# EAGLE design App_Board_V1.31 (EAGLE 9.6.2)
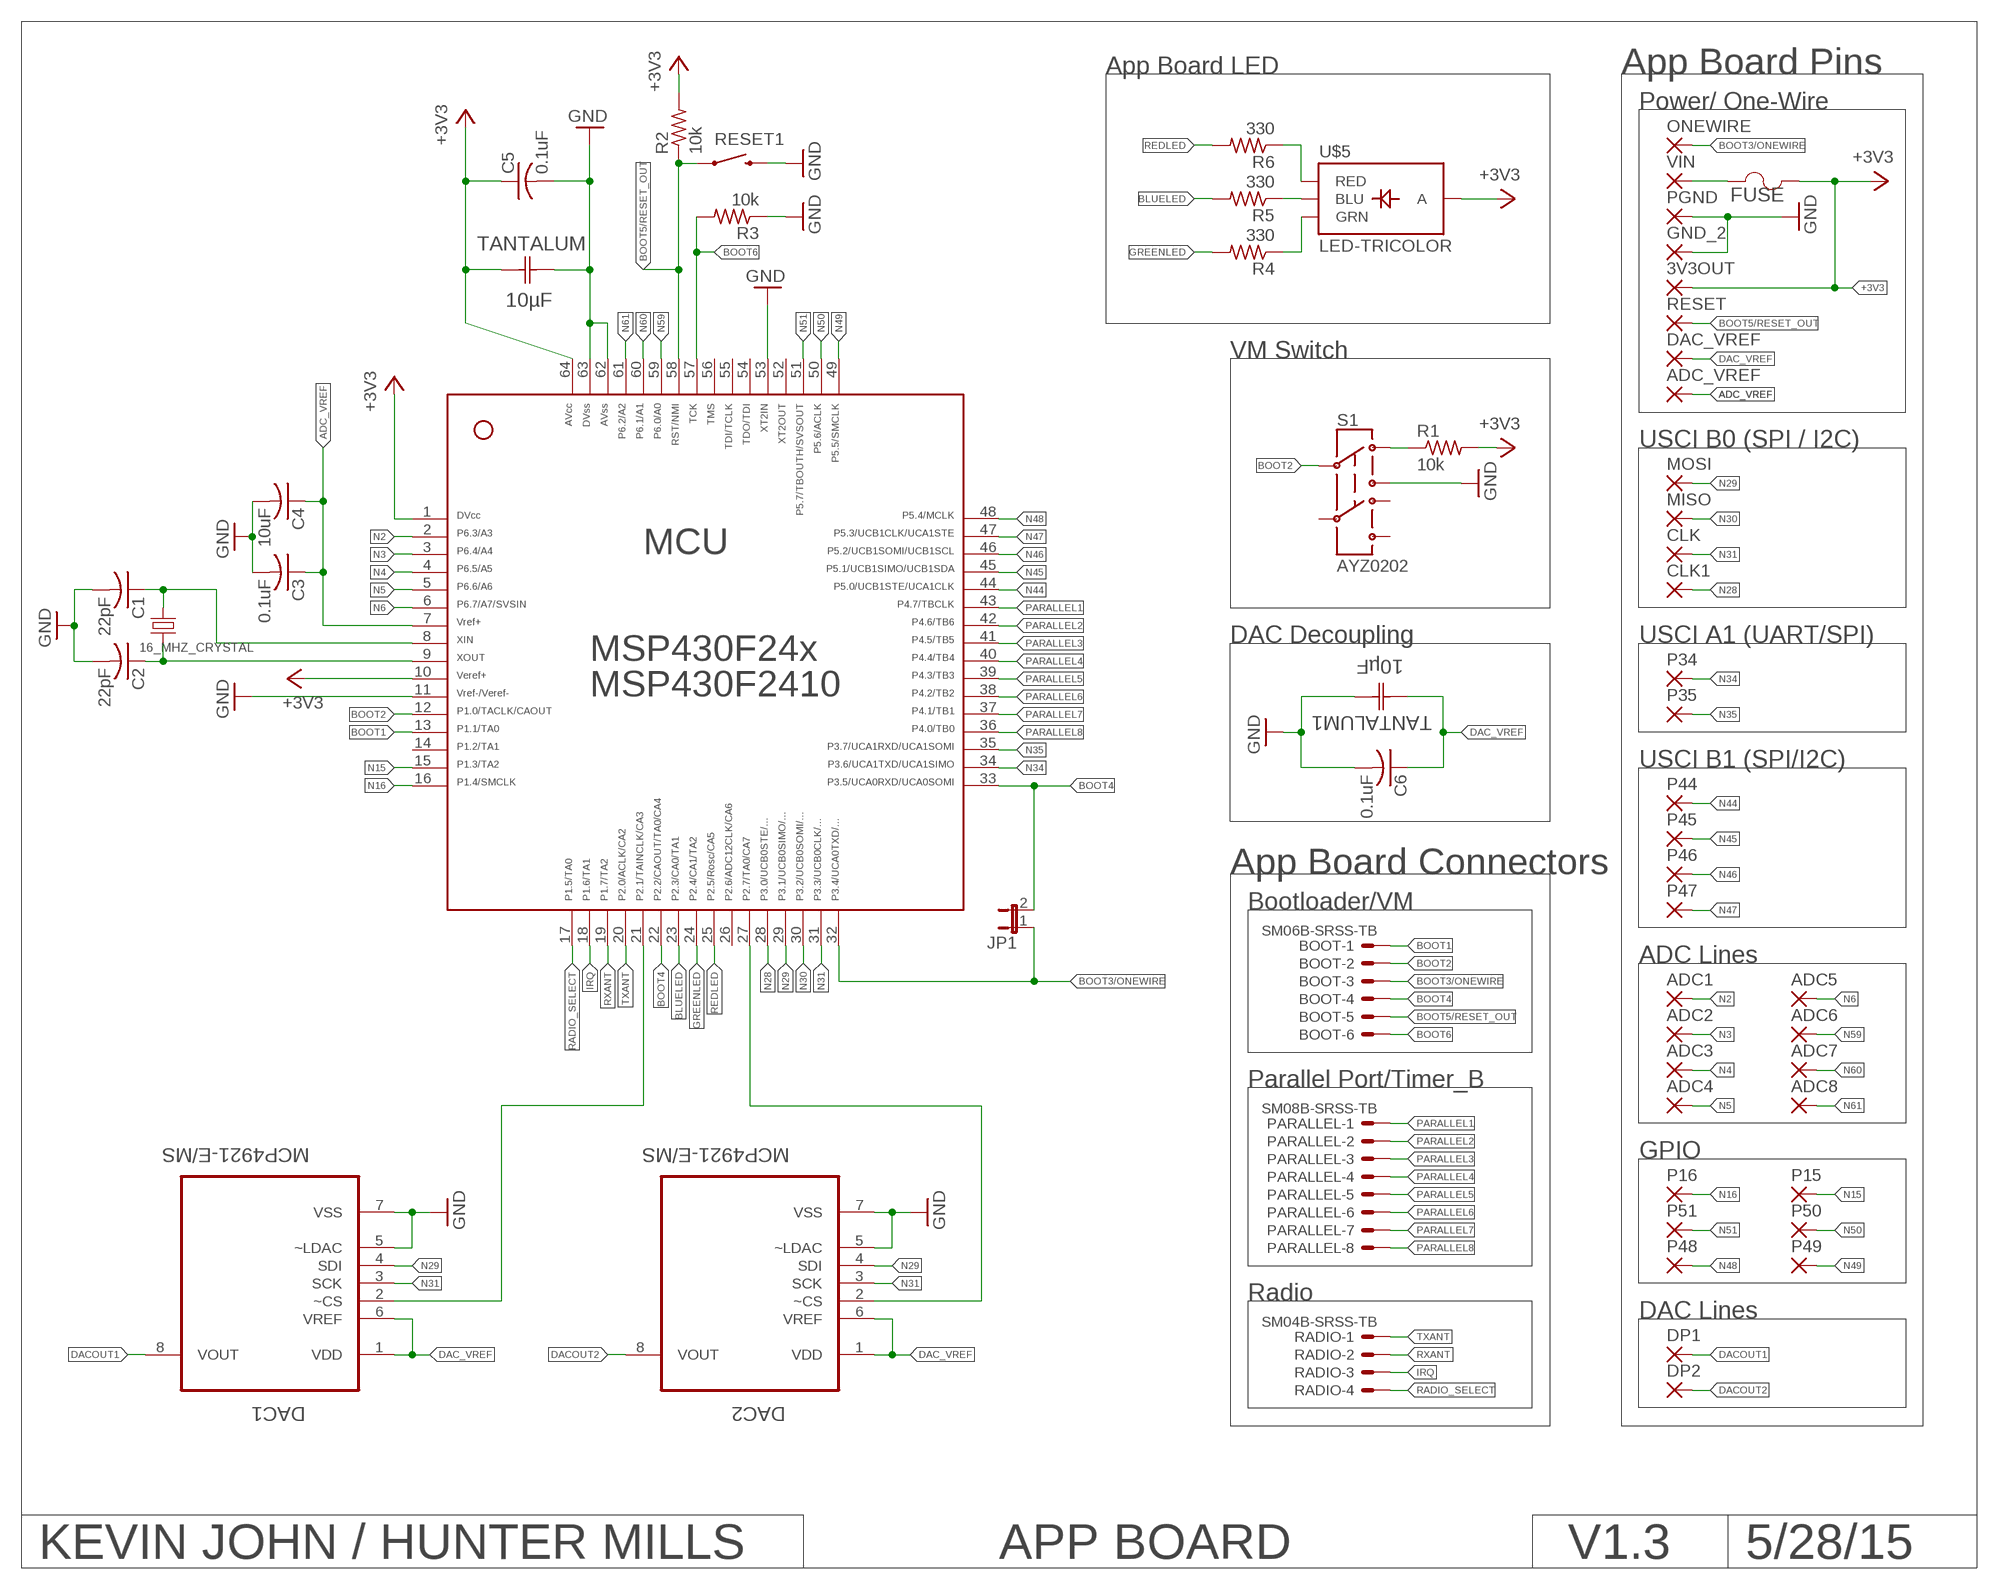
[diagram p0: schematic, sheet 1]

## Parts
3V3OUT  1,6/0,9  [1,6/0,9]
16_MHZ_CRYSTAL  HUNTERCRYSTAL  [CRYSTAL-SMD-5X3]
ADC1  1,6/0,9  [1,6/0,9]
ADC2  1,6/0,9  [1,6/0,9]
ADC3  1,6/0,9  [1,6/0,9]
ADC4  1,6/0,9  [1,6/0,9]
ADC5  1,6/0,9  [1,6/0,9]
ADC6  1,6/0,9  [1,6/0,9]
ADC7  1,6/0,9  [1,6/0,9]
ADC8  1,6/0,9  [1,6/0,9]
ADC_VREF  1,6/0,9  [1,6/0,9]
BOOT  SM06B-SRSS-TB  [SM06B-SRSS-TB]
C1  22pF  C-USC0805  [C0805]
C2  22pF  C-USC0805  [C0805]
C3  0.1uF  C-USC0805  [C0805]
C4  10uF  C-USC0805  [C0805]
C5  0.1uF  C-USC0805  [C0805]
C6  0.1uF  C-USC0805  [C0805]
CLK  1,6/0,9  [1,6/0,9]
CLK1  1,6/0,9  [1,6/0,9]
DAC1  MCP4921-E/MS  [SOP65P490X110-8N]
DAC2  MCP4921-E/MS  [SOP65P490X110-8N]
DAC_VREF  1,6/0,9  [1,6/0,9]
DP1  1,6/0,9  [1,6/0,9]
DP2  1,6/0,9  [1,6/0,9]
FUSE  HUNTERFUSE  [CAPC4532X254N]
GND_2  1,6/0,9  [1,6/0,9]
JP1  JP1E  [JP1]
MCU  F24[X/10]---PM64  [PM/PAG64]
MISO  1,6/0,9  [1,6/0,9]
MOSI  1,6/0,9  [1,6/0,9]
ONEWIRE  1,6/0,9  [1,6/0,9]
P15  1,6/0,9  [1,6/0,9]
P16  1,6/0,9  [1,6/0,9]
P34  1,6/0,9  [1,6/0,9]
P35  1,6/0,9  [1,6/0,9]
P44  1,6/0,9  [1,6/0,9]
P45  1,6/0,9  [1,6/0,9]
P46  1,6/0,9  [1,6/0,9]
P47  1,6/0,9  [1,6/0,9]
P48  1,6/0,9  [1,6/0,9]
P49  1,6/0,9  [1,6/0,9]
P50  1,6/0,9  [1,6/0,9]
P51  1,6/0,9  [1,6/0,9]
PARALLEL  SM08B-SRSS-TB  [SM08B-SRSS-TB]
PGND  1,6/0,9  [1,6/0,9]
R1  10k  R-US_R0603  [R0603]
R2  10k  R-US_R0603  [R0603]
R3  10k  R-US_R0603  [R0603]
R4  330  R-US_R0603  [R0603]
R5  330  R-US_R0603  [R0603]
R6  330  R-US_R0603  [R0603]
RADIO  SM04B-SRSS-TB  [SM04B-SRSS-TB]
RESET  1,6/0,9  [1,6/0,9]
RESET1  SWITCH-MOMENTARY-2SMD  [TACTILE-SWITCH-SMD]
S1  AYZ0202  [AYZ0202]
TANTALUM  10µF  TAJT106K016R  [CAPCP3528X120N]
TANTALUM1  10µF  TAJT106K016R  [CAPCP3528X120N]
U$5  LED-TRICOLOR  [LED-TRICOLOR-SMD]
VIN  1,6/0,9  [1,6/0,9]

## Nets
3.3VOUT: FUSE.1 VIN.1(P)
+3V3: 3V3OUT.1(P) C5.1 FUSE.2 MCU.1 MCU.10 MCU.64 R1.2 R2.2 TANTALUM.1(C1) U$5.A
ADC_VREF [Standard]: ADC_VREF.1(P) C3.1 C4.1 MCU.7
BLUELED: MCU.23 R5.2
BOOT1: BOOT.1 MCU.13
BOOT2: BOOT.2 MCU.12 S1.2
BOOT3/ONEWIRE: BOOT.3 JP1.1 MCU.32 ONEWIRE.1(P)
BOOT4: BOOT.4 JP1.2 MCU.22 MCU.33
BOOT5/RESET_OUT: BOOT.5 MCU.58 R2.1 RESET1.1 RESET.1(P)
BOOT6: BOOT.6 MCU.57 R3.2
DAC_VREF: C6.1 DAC1.1(VDD) DAC1.6(VREF) DAC2.1(VDD) DAC2.6(VREF) DAC_VREF.1(P) TANTALUM1.1(C1)
DACOUT1: DAC1.8(VOUT) DP1.1(P)
DACOUT2: DAC2.8(VOUT) DP2.1(P)
GND [Standard]: C1.2 C2.2 C3.2 C4.2 C5.2 C6.2 DAC1.5(~LDAC) DAC1.7(VSS) DAC2.5(~LDAC) DAC2.7(VSS) GND_2.1(P) MCU.11 MCU.53 MCU.62 MCU.63 PGND.1(P) R3.1 RESET1.3 S1.1 TANTALUM1.2(C2) TANTALUM.2(C2)
GREENLED: MCU.24 R4.2
IRQ: MCU.18 RADIO.3
N2: ADC1.1(P) MCU.2
N3: ADC2.1(P) MCU.3
N4: ADC3.1(P) MCU.4
N5: ADC4.1(P) MCU.5
N6: ADC5.1(P) MCU.6
N15: MCU.15 P15.1(P)
N16: MCU.16 P16.1(P)
N28: CLK1.1(P) MCU.28
N29: DAC1.4(SDI) DAC2.4(SDI) MCU.29 MOSI.1(P)
N30: MCU.30 MISO.1(P)
N31: CLK.1(P) DAC1.3(SCK) DAC2.3(SCK) MCU.31
N34: MCU.34 P34.1(P)
N35: MCU.35 P35.1(P)
N44: MCU.44 P44.1(P)
N45: MCU.45 P45.1(P)
N46: MCU.46 P46.1(P)
N47: MCU.47 P47.1(P)
N48: MCU.48 P48.1(P)
N49: MCU.49 P49.1(P)
N50: MCU.50 P50.1(P)
N51: MCU.51 P51.1(P)
N59: ADC6.1(P) MCU.59
N60: ADC7.1(P) MCU.60
N61: ADC8.1(P) MCU.61
N$1: 16_MHZ_CRYSTAL.3 C1.1 MCU.8
N$2: 16_MHZ_CRYSTAL.1 C2.1 MCU.9
N$3: R1.1 S1.3
N$4: R5.1 U$5.B(BLU)
N$5: R6.1 U$5.R(RED)
N$6: R4.1 U$5.G(GRN)
N$7: DAC1.2(~CS) MCU.21
N$8: DAC2.2(~CS) MCU.27
PARALLEL1: MCU.43 PARALLEL.1
PARALLEL2: MCU.42 PARALLEL.2
PARALLEL3: MCU.41 PARALLEL.3
PARALLEL4: MCU.40 PARALLEL.4
PARALLEL5: MCU.39 PARALLEL.5
PARALLEL6: MCU.38 PARALLEL.6
PARALLEL7: MCU.37 PARALLEL.7
PARALLEL8: MCU.36 PARALLEL.8
RADIO_SELECT: MCU.17 RADIO.4
REDLED: MCU.25 R6.2
RXANT: MCU.19 RADIO.2
TXANT: MCU.20 RADIO.1
Unconnected: MCU.14 MCU.26 MCU.52 MCU.54 MCU.55 MCU.56 S1.4 S1.5 S1.6

## Notes on the sheet
- App Board LED | App Board Pins
- Power/ One-Wire
- VM Switch
- USCI B0 (SPI / I2C)
- DAC Decoupling | USCI A1 (UART/SPI)
- USCI B1 (SPI/I2C)
- App Board Connectors
- Bootloader/VM
- ADC Lines
- Parallel Port/Timer_B
- GPIO
- Radio
- DAC Lines
- KEVIN JOHN / HUNTER MILLS | APP BOARD | V1.3 | 5/28/15

## Library data of the parts
3V3OUT ADC1-ADC8 ADC_VREF CLK CLK1 DAC_VREF DP1 DP2 GND_2 MISO MOSI ONEWIRE P15 P16 P34 P35 P44-P51 PGND RESET VIN = wirepad:1,6/0,9: THROUGH-HOLE PAD
16_MHZ_CRYSTAL = SparkFun-FreqCtrl:HUNTERCRYSTAL
BOOT = con-jst2:?M06B-SRSS-TB: Disconnectable Crimp style connector, 1.0mm pitch 6 contacts
C1-C6 = rcl:C-US: CAPACITOR, American symbol
DAC1 DAC2 = Microchip_By_element14_Batch_1:MCP4921-E/MS: Digital-to-Analog Converter; MPN: MCP4921-E/MS; OC_FARNELL: 1834916; OC_NEWARK: 08J8742; PACKAGE: SOP-8; SUPPLIER: Microchip
FUSE = AVX_By_element14_Batch_1:HUNTERFUSE
JP1 = jumper:JP1E: JUMPER
MCU = TI_MSP430_v16:F24[X/10]---PM64: ***MSP430F24[x/10]***PM64
PARALLEL = con-jst2:?M08B-SRSS-TB: Disconnectable Crimp style connector, 1.0mm pitch 8 contacts
R1-R6 = rcl:R-US_: RESISTOR, American symbol
RADIO = con-jst2:?M04B-SRSS-TB: Disconnectable Crimp style connector, 1.0mm pitch 4 contacts
RESET1 = SparkFun-Electromechanical:SWITCH-MOMENTARY-2: Various NO switches- pushbuttons, reed, etc; PROD_ID: SWCH-08247
S1 = SparkFun-Electromechanical:AYZ0202: SPDT Slide Switch Simple SMD single-pull double-throw slide switch. Good for less than 350mA power switch, switching UARTs between devices, etc. Spark Fun Electronics SKU : COM-00597; PROD_ID: SWCH-08179
TANTALUM TANTALUM1 = AVX_By_element14_Batch_1:TAJT106K016R: Tantalum Capacitor , 1210; CAPACITANCETOLERANCE: ± 10%; MPN: TAJT106K016R; OC_FARNELL: -; OC_NEWARK: 09R6231; SUPPLIER: AVX; VOLTAGERATING: 16V
U$5 = SparkFun-LED:LED-TRICOLOR: Tri-Color LED SMD Proven layout and schematic for triple color LED in SMD package - common anode. Spark Fun Electronics SKU : COM-07844

## Net classes
1 Standard: width 0.152 mm, drill 0.152 mm, clearance 0.152 mm

## Board
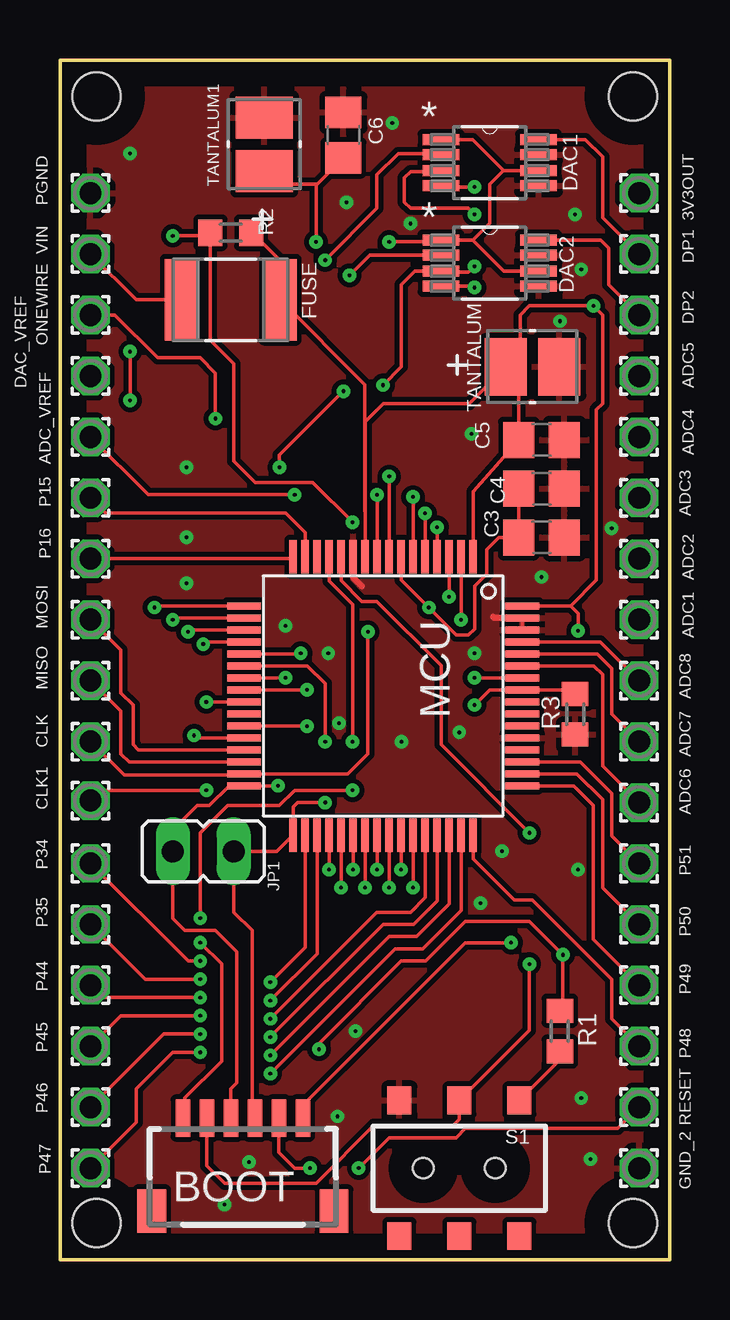
[diagram p1: board, top side]
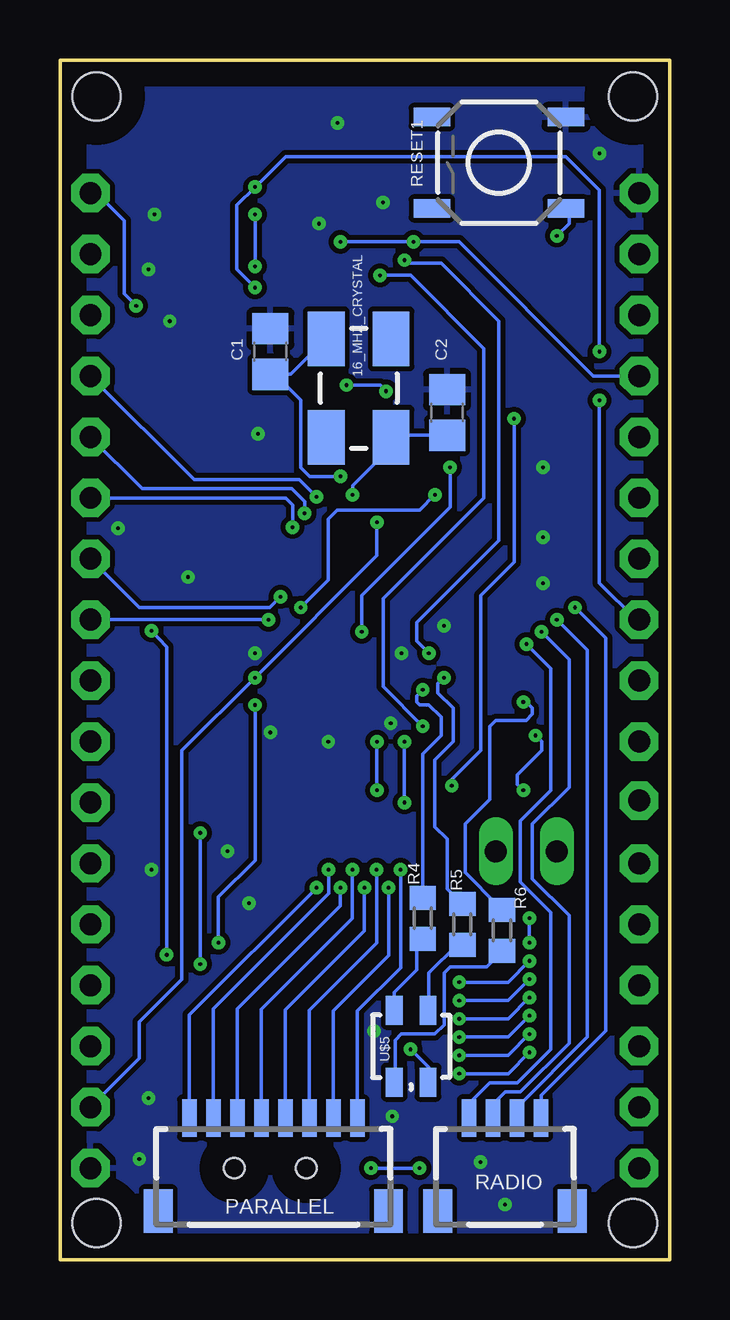
[diagram p2: board, bottom side, seen from below]

Size 25.4 x 50 mm. Coordinates in mm from the lower left corner, seen from the top.
Outline: 0,0 25.4,0 25.4,50 0,50 0,0
Copper layers (1*16): Top 0.035mm / dielectric 1.5mm / Bottom 0.035mm
Design rules "default": minimum track width 10mil, minimum drill 24mil, track to track 8mil, track to pad 8mil, pad to pad 8mil, via to via 8mil, smd to smd 8mil, copper to edge 40mil, drill to drill 8mil, minimum pad ring 10mil, minimum via ring 8mil, stop-mask expansion 4mil, vias tented up to drill 0mil, thermal gap 10mil
Holes 2 mm at 1.52,48.48 23.88,48.48 1.52,1.52 23.88,1.52

### Footprints (pad centres in the part's own frame; a part is rotated, then mirrored left to right if it is on the bottom)
1,6/0,9 = drill 0.914 pad 1.6 octagon: 1 0,0
CRYSTAL-SMD-5X3 = smd 2.286 x 1.524: 1 -2.053,-1.353; 2 2.053,-1.353; 3 2.053,1.353; 4 -2.053,1.353
SM06B-SRSS-TB = smd 0.6 x 1.55: 1 -2.5,2.975; 2 -1.5,2.975; 3 -0.5,2.975; 4 0.5,2.975; 5 1.5,2.975; 6 2.5,2.975 | smd 1.2 x 1.8: FIT@1 -3.8,-0.9; FIT@2 3.8,-0.9
C0805 = smd 1.3 x 1.5: 1 -0.95,0; 2 0.95,0
SOP65P490X110-8N = smd 1.524 x 0.457: 1 -2.032,0.965; 2 -2.032,0.33; 3 -2.032,-0.33; 4 -2.032,-0.965; 5 2.032,-0.965; 6 2.032,-0.33; 7 2.032,0.33; 8 2.032,0.965
CAPC4532X254N = smd 1.372 x 3.404: 1 -2.057,0; 2 2.057,0
JP1 = drill 0.914 long: 1 0,-1.27; 2 0,1.27
PM/PAG64 = smd 1.4 x 0.3: 1 -5.8,3.75; 2 -5.8,3.25; 3 -5.8,2.75; 4 -5.8,2.25; 5 -5.8,1.75; 6 -5.8,1.25; 7 -5.8,0.75; 8 -5.8,0.25; 9 -5.8,-0.25; 10 -5.8,-0.75; 11 -5.8,-1.25; 12 -5.8,-1.75; 13 -5.8,-2.25; 14 -5.8,-2.75; 15 -5.8,-3.25; 16 -5.8,-3.75; 33 5.8,-3.75; 34 5.8,-3.25; 35 5.8,-2.75; 36 5.8,-2.25; 37 5.8,-1.75; 38 5.8,-1.25; 39 5.8,-0.75; 40 5.8,-0.25; 41 5.8,0.25; 42 5.8,0.75; 43 5.8,1.25; 44 5.8,1.75; 45 5.8,2.25; 46 5.8,2.75; 47 5.8,3.25; 48 5.8,3.75 | smd 0.3 x 1.4: 17 -3.75,-5.8; 18 -3.25,-5.8; 19 -2.75,-5.8; 20 -2.25,-5.8; 21 -1.75,-5.8; 22 -1.25,-5.8; 23 -0.75,-5.8; 24 -0.25,-5.8; 25 0.25,-5.8; 26 0.75,-5.8; 27 1.25,-5.8; 28 1.75,-5.8; 29 2.25,-5.8; 30 2.75,-5.8; 31 3.25,-5.8; 32 3.75,-5.8; 49 3.75,5.8; 50 3.25,5.8; 51 2.75,5.8; 52 2.25,5.8; 53 1.75,5.8; 54 1.25,5.8; 55 0.75,5.8; 56 0.25,5.8; 57 -0.25,5.8; 58 -0.75,5.8; 59 -1.25,5.8; 60 -1.75,5.8; 61 -2.25,5.8; 62 -2.75,5.8; 63 -3.25,5.8; 64 -3.75,5.8
SM08B-SRSS-TB = smd 0.6 x 1.55: 1 -3.5,2.975; 2 -2.5,2.975; 3 -1.5,2.975; 4 -0.5,2.975; 5 0.5,2.975; 6 1.5,2.975; 7 2.5,2.975; 8 3.5,2.975 | smd 1.2 x 1.8: FIT@1 -4.8,-0.9; FIT@2 4.8,-0.9
R0603 = smd 1 x 1.1: 1 -0.85,0; 2 0.85,0
SM04B-SRSS-TB = smd 0.6 x 1.55: 1 -1.5,2.975; 2 -0.5,2.975; 3 0.5,2.975; 4 1.5,2.975 | smd 1.2 x 1.8: FIT@1 -2.8,-0.9; FIT@2 2.8,-0.9
TACTILE-SWITCH-SMD = smd 1.524 x 0.762: 1 -2.794,1.905; 2 2.794,1.905; 3 -2.794,-1.905; 4 2.794,-1.905
AYZ0202 = smd 1 x 1.15: 1 -2.5,2.825; 2 0,2.825; 3 2.5,2.825; 4 -2.5,-2.825; 5 0,-2.825; 6 2.5,-2.825 | hole 0.85: 1.5,0; -1.5,0
CAPCP3528X120N = smd 1.753 x 2.388: 1 -1.118,0; 2 1.118,0
LED-TRICOLOR-SMD = smd 0.7 x 1.2: A 0.7,-1.5; B 0.7,1.5; G -0.7,1.5; R -0.7,-1.5

### Placement (x,y rotation side)
3V3OUT  24.13,44.45 0 top
16_MHZ_CRYSTAL  12.95,36.32 90 bottom
ADC1  24.13,26.67 270 top
ADC2  24.13,29.21 0 top
ADC3  24.13,31.75 0 top
ADC4  24.13,34.29 0 top
ADC5  24.13,36.83 0 top
ADC6  24.13,19.05 0 top
ADC7  24.13,21.59 0 top
ADC8  24.13,24.13 0 top
ADC_VREF  1.27,34.29 0 top
BOOT  7.62,2.92 0 top
C1  16.64,37.85 90 bottom
C2  9.27,35.31 90 bottom
C3  20.07,30.1 0 top
C4  20.07,32.13 0 top
C5  20.07,34.16 0 top
C6  11.81,46.86 90 top
CLK  1.27,21.59 0 top
CLK1  1.27,19.13 0 top
DAC1  17.91,45.72 0 top
DAC2  17.91,41.53 0 top
DAC_VREF  1.27,36.83 0 top
DP1  24.13,41.91 0 top
DP2  24.13,39.37 0 top
FUSE  7.11,40.01 0 top
GND_2  24.13,3.81 0 top
JP1  5.97,17.02 270 top
MCU  13.46,23.5 270 top
MISO  1.27,24.13 0 top
MOSI  1.27,26.67 0 top
ONEWIRE  1.27,39.37 0 top
P15  1.27,31.75 0 top
P16  1.27,29.21 0 top
P34  1.27,16.51 0 top
P35  1.27,13.97 0 top
P44  1.27,11.43 0 top
P45  1.27,8.89 0 top
P46  1.27,6.35 0 top
P47  1.27,3.81 0 top
P48  24.13,8.89 0 top
P49  24.13,11.43 0 top
P50  24.13,13.97 0 top
P51  24.13,16.51 0 top
PARALLEL  16.51,2.92 0 bottom
PGND  1.27,44.45 0 top
R1  20.83,9.53 90 top
R2  7.11,42.8 0 top
R3  21.46,22.73 90 top
R4  10.29,14.22 90 bottom
R5  8.64,13.97 90 bottom
R6  6.99,13.72 90 bottom
RADIO  6.86,2.92 0 bottom
RESET  24.13,6.35 0 top
RESET1  7.11,45.72 180 bottom
S1  16.64,3.81 0 top
TANTALUM  19.68,37.21 0 top
TANTALUM1  8.51,46.48 90 top
U$5  10.77,8.89 0 bottom
VIN  1.27,41.91 0 top

### Tracks (layer width: path | path; a pad name or v marks a point on that pad's centre or on a via)
3.3VOUT
  Top 0.152: FUSE.1 3.17,40.01 VIN.1
+3V3  (via drill 0.15)
  Top 0.152: 19.37,36.92 TANTALUM.1 | MCU.1 17.21,32.01 C5.1 19.12,37.23 19.06,37.29 | MCU.64 21.28,27.25 | 21.28,27.25 22.35,28.32 22.35,35.43 22.61,35.69 22.61,39.37 v22.23,39.75 19.56,39.75 19.18,39.37 19.18,37.31 19.06,37.29 | 19.06,37.29 TANTALUM.1 | 9.14,40.03 FUSE.2 | FUSE.2 12.71,36.47 12.71,31.19 MCU.10 12.71,34.94 13.46,35.69 17.04,35.69 TANTALUM.1 | R1.2 20.83,10.41 20.95,10.54 v20.95,12.7 19.56,14.1 16.89,14.1 15.24,12.45 14.22,12.45 10.79,9.02 v10.79,8.76 | v21.59,26.21 21.59,26.93 21.28,27.25 | 8,42.8 9.17,41.63 FUSE.2
  Top 0.406: R2.2 8,42.8
  Bottom 0.152: 3V3OUT.1 23.88,44.45 22.73,43.31 22.73,40.26 v22.23,39.75 | U$5.A 10.07,7.28 10.03,7.24 10.03,8 v10.79,8.76 | v20.95,12.7 20.95,25.53 v21.59,26.21
ADC_VREF  (via drill 0.15)
  Top 0.152: C4.1 C3.1 18.29,30.1 17.78,29.59 17.78,28.57 17.27,28.07 17.27,26.29 17.02,26.04 16.51,26.04 v15.37,27.18 14.22,28.32 14.22,29.28 MCU.7 | ADC_VREF.1 3.68,31.88 v9.78,31.88
  Bottom 0.152: v9.78,31.88 10.41,31.24 13.84,31.24 14.22,30.86 14.22,28.32 v15.37,27.18
BLUELED  (via drill 0.15)
  Top 0.152: MCU.23 9.01,24.25 v9.4,24.26
  Bottom 0.152: R5.2 9.27,15.46 9.27,17.53 9.78,18.03 9.78,20.83 9.02,21.59 9.02,22.99 9.65,23.62 9.65,24 v9.4,24.26
BOOT1  (via drill 0.15)
  Top 0.152: 5.08,5.35 BOOT.1 5.21,5.47 5.21,6.73 6.73,8.26 6.73,12.32 v5.84,13.21 | v12.19,19.56 9.78,19.56 9.14,18.92 6.99,18.92 5.84,17.78 v5.84,14.22 | MCU.13 11.21,28.29 12.19,27.3 v12.19,21.59
  Bottom 0.152: v5.84,13.21 v5.84,14.22 | v12.19,19.56 v12.19,21.59
BOOT2  (via drill 0.15)
  Top 0.152: MCU.12 11.71,28.29 12.57,27.43 13.21,27.43 15.88,24.77 15.88,21.46 v19.56,17.78 | v19.56,12.32 19.56,9.56 S1.2 16.64,5.84 16.38,5.59 13.08,5.59 10.67,3.17 6.86,3.17 6.12,3.91 BOOT.2
  Bottom 0.152: v19.56,17.78 v19.56,12.32
BOOT3/ONEWIRE  (via drill 0.15)
  Top 0.152: BOOT.3 7.24,5.51 7.11,5.63 7.11,7.11 7.37,7.37 7.37,12.83 6.48,13.72 5.21,13.72 4.7,14.22 JP1.1 4.7,17.91 5.71,18.92 6.22,18.92 7.04,19.75 MCU.32 v9.08,19.75 | ONEWIRE.1 2.29,39.37 4.06,37.59 5.84,37.59 6.48,36.96 v6.48,35.05
  Bottom 0.152: v6.48,35.05 6.48,29.08 7.87,27.69 7.87,21.21 9.08,20.01 v9.08,19.75
BOOT4  (via drill 0.15)
  Top 0.152: v11.05,19.05 9.91,19.05 9.71,18.86 MCU.33 9.04,17.02 JP1.2 7.24,14.48 8,13.72 8,5.51 BOOT.4 | MCU.22 10.31,24.75 11.05,24 v11.05,21.59
  Bottom 0.152: v11.05,19.05 v11.05,21.59
BOOT5/RESET_OUT  (via drill 0.15)
  Top 0.152: v10.41,3.81 9.78,3.81 9.12,4.47 BOOT.5 | v12.19,30.73 10.54,32.38 8.13,32.38 7.24,33.27 7.24,37.34 6.26,38.31 R2.1 6.13,42.67 v4.7,42.67 | MCU.58 17.28,24.25 v17.27,24.26 | RESET.1 23.24,5.46 16.89,5.46 16.51,5.08 13.72,5.08 v12.45,3.81
  Bottom 0.152: v4.7,42.67 4.19,43.18 4.19,43.69 RESET1.1 | RESET.1 22.1,8.38 22.1,9.91 20.32,11.68 20.32,21.21 v17.27,24.26 12.19,29.34 v12.19,30.73 | v10.41,3.81 v12.45,3.81
BOOT6  (via drill 0.15)
  Top 0.152: R3.2 21.3,23.75 MCU.57 17.9,23.75 v17.27,23.11 | BOOT.6 10.12,6.44 16.89,13.21 v18.8,13.21
  Bottom 0.152: v17.27,23.11 17.27,16.64 18.8,15.11 v18.8,13.21
DAC_VREF  (via drill 0.15)
  Top 0.152: 17.2,42.49 DAC2.1 15.8,42.42 v13.72,42.42 | 17.2,42.49 18.49,41.2 DAC2.6 | DAC1.1 17.2,46.69 18.49,45.39 | DAC1.6 18.49,45.39 | 18.49,45.39 18.47,45.39 17.91,44.83 17.91,43.2 17.2,42.49 | TANTALUM1.1 8.76,44.96 8.89,44.83 10.73,44.83 | 10.73,44.83 C6.1 10.73,44.83 | 10.73,44.83 10.67,44.77 v10.67,42.42
  Bottom 0.152: DAC_VREF.1 3.17,36.83 8.76,42.42 v10.67,42.42 v13.72,42.42
DACOUT1
  Top 0.152: DAC1.8 21.89,46.69 22.61,45.97 22.61,43.43 DP1.1
DACOUT2
  Top 0.152: DAC2.8 22.53,42.49 22.86,42.16 22.86,40.64 DP2.1
GND  (via drill 0.15)
  Top 0.152: 21.27,37.17 TANTALUM.2 | MCU.62 MCU.63 | 19.99,46.1 DAC1.7
  Top 0.254: MCU.63 18.09,26.75 18.03,26.8 | MCU.11 12.21,28.43 12.57,28.07
  Bottom 0.152: 16.64,38.86 C1.2
  other vias: 11.94,44.07 14.61,43.18 17.14,34.42 21.72,6.73 14.22,21.59 11.62,22.35 5.27,28.19 5.27,30.1 5.27,33.02 16.64,21.97 20.83,39.12 11.56,5.97 7.87,4.06 6.86,2.29 17.53,14.86 18.41,17.02 11.18,25.27 9.4,26.42 21.59,16.26 20.07,28.45 22.99,30.48 17.27,25.27 2.92,46.1 13.84,47.37 21.46,43.56 21.72,41.27 22.1,4.19 12.32,9.53
  pour Top: 0,0 0,50.04 25.4,50.04 25.4,0
  pour Bottom: 0,0 25.4,0 25.4,50.04 0,50.04
GREENLED  (via drill 0.15)
  Top 0.152: MCU.24 v10.29,23.75
  Bottom 0.152: R4.2 10.29,21.08 9.53,21.84 9.53,22.61 10.03,23.11 10.41,23.11 10.54,23.24 10.54,23.5 v10.29,23.75
IRQ  (via drill 0.15)
  Top 0.152: MCU.18 4.77,26.75 v4.7,26.67
  Bottom 0.152: v4.7,26.67 3.43,25.4 3.43,9.27 6.36,6.34 RADIO.3
N2  (via drill 0.15)
  Top 0.152: MCU.2 v16.71,26.66
  Bottom 0.152: ADC1.1 v16.72,26.67 v16.71,26.66
N3  (via drill 0.15)
  Top 0.152: MCU.3 v16.21,27.63 v16.21,27.62
  Bottom 0.152: ADC2.1 22.1,27.18 16.66,27.18 v16.21,27.62
N4  (via drill 0.15)
  Top 0.152: MCU.4 v15.71,30.52 v15.71,30.53
  Bottom 0.152: ADC3.1 16,31.75 15.71,31.46 v15.71,30.53
N5  (via drill 0.15)
  Top 0.152: MCU.5 v15.21,31.1 | v15.21,31.1
  Bottom 0.152: ADC4.1 21.97,32.13 15.75,32.13 15.21,31.59 v15.21,31.1
N6  (via drill 0.15)
  Top 0.152: MCU.6 v14.71,31.79
  Bottom 0.152: ADC5.1 19.81,32.51 15.43,32.51 v14.71,31.79
N15
  Top 0.152: MCU.15 10.21,30.3 9.4,31.11 1.91,31.11 P15.1
N16
  Top 0.152: MCU.16 9.63,29.21 P16.1
N28  (via drill 0.15)
  Top 0.152: CLK1.1 1.7,19.56 v6.1,19.56 | MCU.28 5.69,21.75 arc-90 v5.59,21.84
  Bottom 0.152: v6.1,19.56 6.35,19.81 6.35,20.19 5.33,21.21 5.33,21.59 v5.59,21.84
N29  (via drill 0.15)
  Top 0.152: DAC1.4 15.93,44.7 v17.27,44.7 | v17.27,40.51 17.22,40.56 DAC2.4 | MCU.29 3.27,21.25 3.05,21.46 3.05,23.11 2.54,23.62 2.54,25.4 MOSI.1 | v2.92,35.81 v2.92,37.85
  Bottom 0.152: MOSI.1 1.4,26.67 2.92,28.19 v2.92,35.81 | v2.92,37.85 2.92,44.58 4.32,45.97 16,45.97 v17.27,44.7 18.03,43.94 18.03,41.27 v17.27,40.51
N30
  Top 0.152: MCU.30 2.88,20.75 2.54,21.08 2.54,22.86 MISO.1
N31  (via drill 0.15)
  Top 0.152: 15.67,45.39 DAC1.3 15.82,45.34 14.61,45.34 14.35,45.09 14.35,44.07 14.61,43.81 17.02,43.81 v17.27,43.56 | CLK.1 2.67,20.19 7.11,20.19 7.16,20.25 MCU.31 11.99,20.25 12.83,21.08 v12.83,26.16 | v13.46,36.45 14.22,37.21 14.22,40.64 14.78,41.2 DAC2.3 15.95,41.27 16.08,41.15 17.02,41.15 v17.27,41.4 | v11.81,36.2 9.14,33.53 v9.14,33.02
  Bottom 0.152: v12.83,26.16 12.83,27.69 9.14,31.37 v9.14,33.02 | v11.81,36.2 12.06,36.45 v13.46,36.45 | v17.27,43.56 v17.27,41.4
N34  (via drill 0.15)
  Top 0.152: MCU.34 10.21,13.01 v8.76,11.56 | v5.84,12.45 5.33,12.45 P34.1
  Bottom 0.152: v8.76,11.56 6.73,11.56 v5.84,12.45
N35  (via drill 0.15)
  Top 0.152: MCU.35 10.71,12.74 v8.76,10.79 | v5.84,11.68 3.56,11.68 P35.1
  Bottom 0.152: v8.76,10.79 6.73,10.79 v5.84,11.68
N44  (via drill 0.15)
  Top 0.152: MCU.44 15.21,15.09 14.61,14.48 13.21,14.48 v8.76,10.03 | v5.84,10.92 1.78,10.92 P44.1
  Bottom 0.152: v8.76,10.03 6.73,10.03 v5.84,10.92
N45  (via drill 0.15)
  Top 0.152: MCU.45 15.71,14.95 14.73,13.97 13.46,13.97 v8.76,9.27 | v5.84,10.16 2.54,10.16 P45.1
  Bottom 0.152: v8.76,9.27 6.73,9.27 v5.84,10.16
N46  (via drill 0.15)
  Top 0.152: MCU.46 16.21,14.81 14.86,13.46 13.72,13.46 v8.76,8.51 | v5.84,9.4 4.32,9.4 P46.1
  Bottom 0.152: v8.76,8.51 6.73,8.51 v5.84,9.4
N47  (via drill 0.15)
  Top 0.152: MCU.47 16.71,14.55 15.11,12.95 13.97,12.95 v8.76,7.75 | v5.84,8.64 4.7,8.64 3.17,7.11 3.17,5.71 P47.1
  Bottom 0.152: v8.76,7.75 6.73,7.75 v5.84,8.64
N48
  Top 0.152: P48.1 22.99,10.03 22.99,11.68 19.68,14.99 18.92,14.99 17.21,16.7 MCU.48
N49
  Top 0.152: MCU.49 21.4,19.75 22.23,18.92 22.23,13.34 P49.1
N50
  Top 0.152: MCU.50 21.54,20.25 22.61,19.18 22.61,15.49 P50.1
N51
  Top 0.152: MCU.51 21.67,20.75 22.99,19.43 22.99,17.65 P51.1
N59
  Top 0.152: MCU.59 22.25,24.75 22.61,24.38 22.61,20.57 ADC6.1
N60
  Top 0.152: MCU.60 22.38,25.25 22.99,24.64 22.99,22.73 ADC7.1
N61
  Top 0.152: MCU.61 22.52,25.75 ADC8.1
N$1  (via drill 0.15)
  Top 0.152: MCU.8 v13.71,32.63 v13.72,32.64
  Bottom 0.152: 16_MHZ_CRYSTAL.3 15.79,36.9 C1.1 16.45,36.9 15.37,35.81 15.37,33.02 14.99,32.64 v13.72,32.64
N$2  (via drill 0.15)
  Top 0.152: MCU.9 v13.21,31.87 v13.21,31.88
  Bottom 0.152: C2.1 11.51,34.36 16_MHZ_CRYSTAL.1 11.6,33.87 13.21,32.26 v13.21,31.88
N$3
  Top 0.152: S1.3 20.83,8.33 R1.1
N$4
  Bottom 0.152: U$5.B 10.03,10.43 10.03,11.94 8.85,13.12 R5.1
N$5
  Bottom 0.152: U$5.R 11.43,7.43 11.43,9.14 11.18,9.4 9.78,9.4 9.4,9.78 9.4,11.94 9.14,12.19 7.62,12.19 6.99,12.83 R6.1
N$6
  Bottom 0.152: U$5.G 11.47,11.14 10.54,12.06 10.54,13.34 10.29,13.59 R4.1
N$7  (via drill 0.15)
  Top 0.152: MCU.21 10.01,25.25 v10.03,25.27 | DAC1.2 15.44,46.05 15.39,46.1 14.1,46.1 13.21,45.21 13.21,43.81 v11.05,41.66
  Bottom 0.152: v11.05,41.66 10.92,41.53 9.53,41.53 7.11,39.12 7.11,29.97 10.54,26.54 10.54,25.78 v10.03,25.27
N$8  (via drill 0.15)
  Top 0.152: DAC2.2 12.9,41.86 v12.06,41.02 | MCU.27 10.27,22.25 v10.29,22.23
  Bottom 0.152: v12.06,41.02 10.79,41.02 7.75,37.97 7.75,31.75 11.94,27.56 11.94,23.88 v10.29,22.23
PARALLEL1  (via drill 0.15)
  Top 0.152: MCU.43 14.71,15.7 v14.71,15.49
  Bottom 0.152: v14.71,15.49 20.01,10.19 PARALLEL.1
PARALLEL2  (via drill 0.15)
  Top 0.152: MCU.42 14.21,16.47 v14.21,16.26
  Bottom 0.152: v14.21,16.26 14.21,15.26 19.01,10.45 PARALLEL.2
PARALLEL3  (via drill 0.15)
  Top 0.152: MCU.41 13.71,15.6 v13.71,15.49
  Bottom 0.152: 18.03,6.17 PARALLEL.3 18.01,10.44 13.72,14.73 v13.72,15.49 v13.71,15.49
PARALLEL4  (via drill 0.15)
  Top 0.152: MCU.40 13.21,16.37 v13.21,16.26
  Bottom 0.152: v13.21,16.26 13.21,14.22 17.01,10.42 PARALLEL.4
PARALLEL5  (via drill 0.15)
  Top 0.152: MCU.39 12.71,15.64 v12.71,15.49
  Bottom 0.152: v12.71,15.49 12.71,13.7 16.01,10.41 PARALLEL.5
PARALLEL6  (via drill 0.15)
  Top 0.152: MCU.38 12.21,16.31 v12.21,16.26
  Bottom 0.152: v12.21,16.26 12.21,13.19 15.01,10.39 PARALLEL.6
PARALLEL7  (via drill 0.15)
  Top 0.152: MCU.37 11.71,15.46 v11.71,15.49
  Bottom 0.152: v11.71,15.49 11.71,12.67 14.01,10.37 PARALLEL.7
PARALLEL8  (via drill 0.15)
  Top 0.152: MCU.36 11.21,16.3 v11.21,16.26
  Bottom 0.152: v11.21,16.26 11.21,12.16 13.01,10.36 PARALLEL.8
RADIO_SELECT  (via drill 0.15)
  Top 0.152: MCU.17 4,27.25 v3.94,27.18
  Bottom 0.152: v3.94,27.18 2.67,25.91 2.67,9.53 5.36,6.83 RADIO.4
REDLED  (via drill 0.15)
  Top 0.152: MCU.25 v6.1,23.24
  Bottom 0.152: R6.2 8.13,15.75 8.51,16.13 8.51,18.16 7.49,19.18 7.49,22.23 7.24,22.48 5.97,22.48 5.71,22.73 5.71,22.99 5.97,23.24 v6.1,23.24
RXANT  (via drill 0.15)
  Top 0.152: MCU.19 5.42,26.25 v5.33,26.16
  Bottom 0.152: v5.33,26.16 4.19,25.02 4.19,19.68 5.71,18.16 5.71,15.88 4.19,14.35 4.19,9.02 6.22,6.99 6.86,6.99 7.36,6.49 RADIO.2
TXANT  (via drill 0.15)
  Top 0.152: MCU.20 6.06,25.75 v5.97,25.65
  Bottom 0.152: v5.97,25.65 4.95,24.64 4.95,19.56 6.22,18.29 6.22,15.75 4.95,14.48 4.95,8.76 6.35,7.37 7.49,7.37 8.36,6.5 RADIO.1

### Text on the board
_bsilk: V 1.3 XXXX-YYYY
200bmp: C:/Users/Kevin/Documents/eagle/AppBoard/lbym.bmp